# Altium project Among.PrjPcb
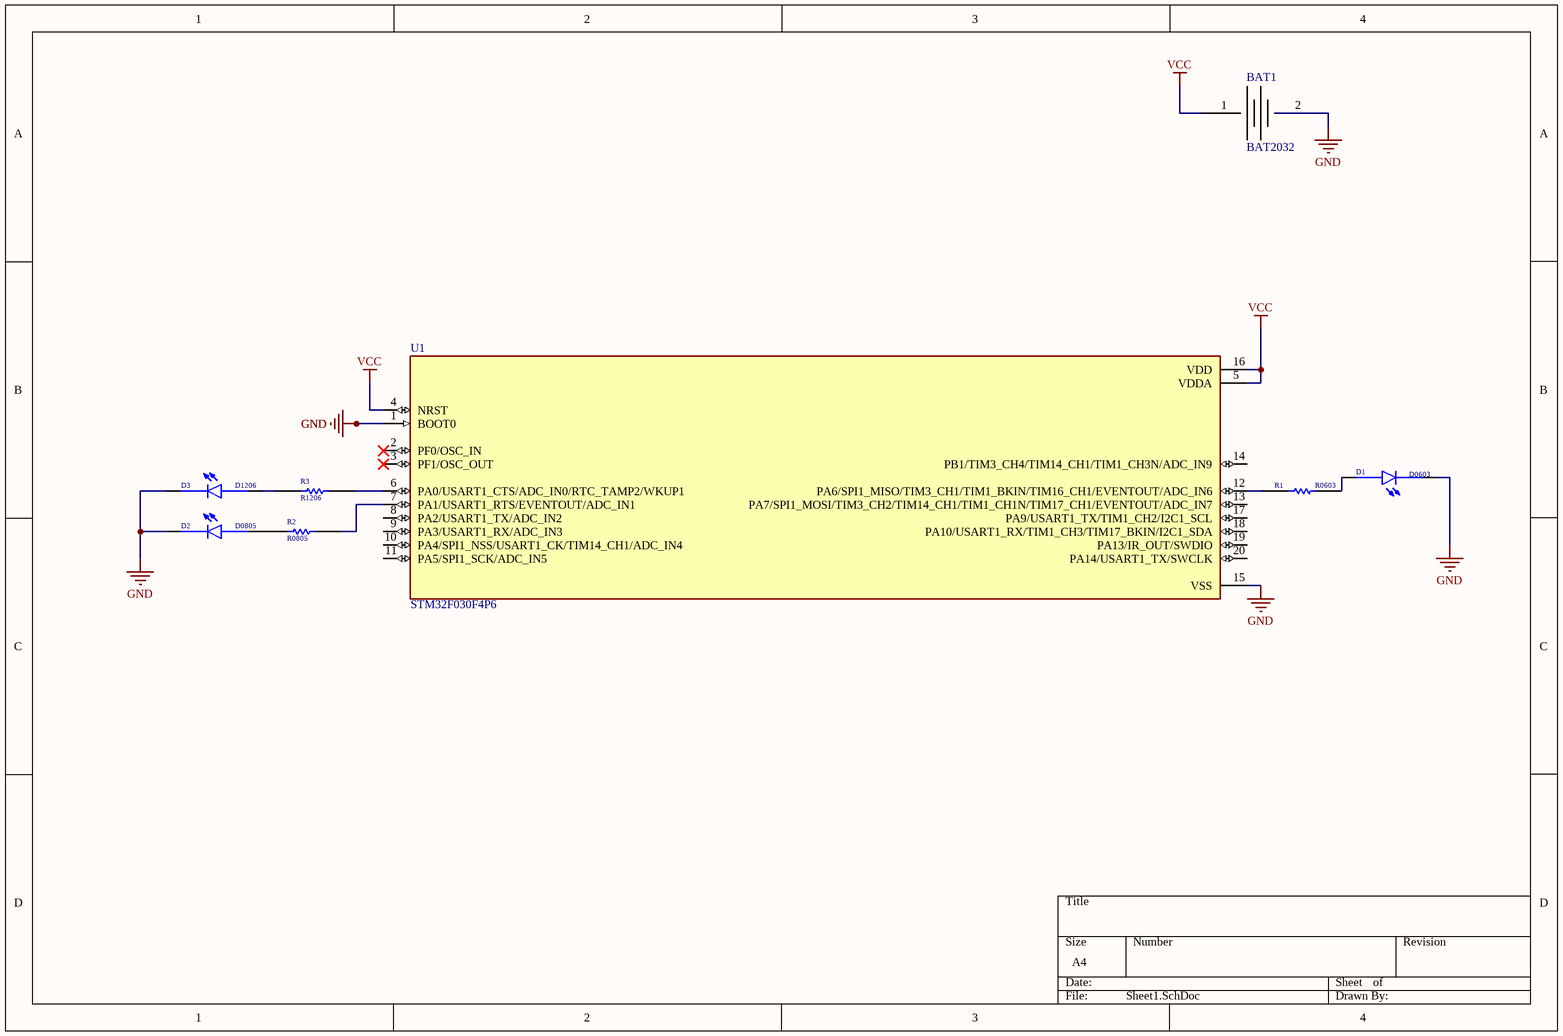
[diagram p0: Sheet1.SchDoc]
1 sheet, 8 parts. Net scope: global (net labels, ports and power ports of the same name join across sheets).
Board file: PCB1.PcbDoc

## Sheet Sheet1.SchDoc
size A4

### Parts
BAT1  BAT2032  [PCBComponent_1]
D1  D0603  [LEDC1608X65N]
D2  D0805  [MY_0805]
D3  D1206  [MY_1206]
R1  R0603  [RESC1508X55N]
R2  R0805  [RESC2012X60]
R3  R1206  [RESC3116X65N]
U1  STM32F030F4P6  [SOP65P640X120-20N]

### Nets
GND: BAT1.2 D1.C D2.C D3.C U1.1(BOOT0) U1.15(VSS)
VCC: BAT1.1 U1.4(NRST) U1.5(VDDA) U1.16(VDD)
NetD1_A: D1.A R1.2
NetD2_A: D2.A R2.2
NetD3_A: D3.A R3.2
NetR1_1: R1.1 U1.12(PA6/SPI1_MISO/TIM3_CH1/TIM1_BKIN/TIM16_CH1/EVENTOUT/ADC_IN6)
NetR2_1: R2.1 U1.7(PA1/USART1_RTS/EVENTOUT/ADC_IN1)
NetR3_1: R3.1 U1.6(PA0/USART1_CTS/ADC_IN0/RTC_TAMP2/WKUP1)

Not connected (* = marked no-connect by the designer): U1 2(PF0/OSC_IN)* 3(PF1/OSC_OUT)* 8(PA2/USART1_TX/ADC_IN2) 9(PA3/USART1_RX/ADC_IN3) 10(PA4/SPI1_NSS/USART1_CK/TIM14_CH1/ADC_IN4) 11(PA5/SPI1_SCK/ADC_IN5) 13(PA7/SPI1_MOSI/TIM3_CH2/TIM14_CH1/TIM1_CH1N/TIM17_CH1/EVENTOUT/ADC_IN7) 14(PB1/TIM3_CH4/TIM14_CH1/TIM1_CH3N/ADC_IN9) 17(PA9/USART1_TX/TIM1_CH2/I2C1_SCL) 18(PA10/USART1_RX/TIM1_CH3/TIM17_BKIN/I2C1_SDA) 19(PA13/IR_OUT/SWDIO) 20(PA14/USART1_TX/SWCLK)

### Library data of the parts
BAT1 = BAT2032: Cell coin 2032
D1 = D0603: White LED Indication - Discrete 3.1V 0603 _1608 Metric_; MP: LTW-C191TLA; MF: Lite-On; Package: 0603 Lite-On; SnapEDA_Link: https://www.snapeda.com/parts/LTW-C191TLA/Lite-On/view-part/538855/?ref=snap; Availability: Unavailable; Price: None; Value: *
D2 = D0805: White LED Indication - Discrete 2.9V 0805 _2012 Metric_; MP: SMLMN2WB1CW1C; MF: Rohm Semiconductor; SnapEDA_Link: https://www.snapeda.com/parts/SMLMN2WB1CW1C/Rohm/view-part/3217279/?ref=snap; Availability: Unavailable; Value: *; Price: None; Package: 0805 Rohm Semiconductor
D3 = D1206: Red 631nm LED Indication - Discrete 2V 1206 _3216 Metric_; MF: Lite-On Inc.; MP: LTST-C230KRKT; Digi-Key_Purchase_URL: https://www.digikey.com/product-detail/en/lite-on-inc/LTST-C230KRKT/160-1457-1-ND/386856?utm_source=snapeda&utm_medium=aggregator&utm_campaign=symbol; Digi-Key_Part_Number: 160-1457-1-ND; Package: 1206 Lite-On; SnapEDA_Link: https://www.snapeda.com/parts/LTST-C230KRKT/Lite-On%20Inc./view-part/358143/?ref=snap; Value: *
R1 = R0603: 0 Ohms Jumper 0.1W, 1/10W Chip Resistor 0603 _1608 Metric_ Automotive AEC-Q200 Thick Film; MP: RMCF0603ZT0R00; MF: Stackpole Electronics Inc; Availability: Unavailable; SnapEDA_Link: https://www.snapeda.com/parts/RMCF0603ZT0R00/Stackpole%20Electronics%20Inc/view-part/3968849/?ref=snap; Package: 1508 Stackpole; Value: *; Price: None
R2 = R0805: 0 Ohms Jumper 0.125W, 1/8W Chip Resistor 0805 (2012 Metric) Moisture Resistant Thick Film; MF: Yageo; MP: RC0805JR-070RL; Value: *; Price: None; Mouser-Purchase-URL: https://snapeda.com/shop?store=Mouser&id=106114; Package: 0805 Yageo; SnapEDA_Link: https://www.snapeda.com/parts/RC0805JR-070RL/Yageo/view-part/106114/?ref=snap; Availability: Unavailable; DigiKey-Purchase-URL: https://snapeda.com/shop?store=DigiKey&id=106114
R3 = R1206: 22 Ohms Â±5% 0.25W, 1/4W Chip Resistor 1206 (3216 Metric) Thick Film; MP: RC1206JR-0722RL; MF: Yageo; Availability: Good; Price: None; SnapEDA_Link: https://www.snapeda.com/parts/RC1206JR-0722RL/Yageo/view-part/615366/?ref=snap; Purchase-URL: https://pricing.snapeda.com/search/part/RC1206JR-0722RL/?ref=eda; Value: *; Package: 3116 Yageo
U1 = STM32F030F4P6: ARMÂ® CortexÂ®-M0 STM32F0 Microcontroller IC 32-Bit 48MHz 16KB _16K x 8_ FLASH; MF: STMicroelectronics; MP: STM32F030F4P6; Package: TSSOP-20 STMicroelectronics; SnapEDA_Link: https://www.snapeda.com/parts/STM32F030F4P6/STMicroelectronics/view-part/46809/?ref=snap; Digi-Key_Purchase_URL: https://www.digikey.vn/product-detail/en/stmicroelectronics/STM32F030F4P6/497-14044-5-ND/4357517?utm_source=snapeda&utm_medium=aggregator&utm_campaign=symbol; Value: *; Digi-Key_Part_Number: 497-14044-5-ND